# EAGLE board bms14921-v2 (EAGLE 4.13), part 1 of 2
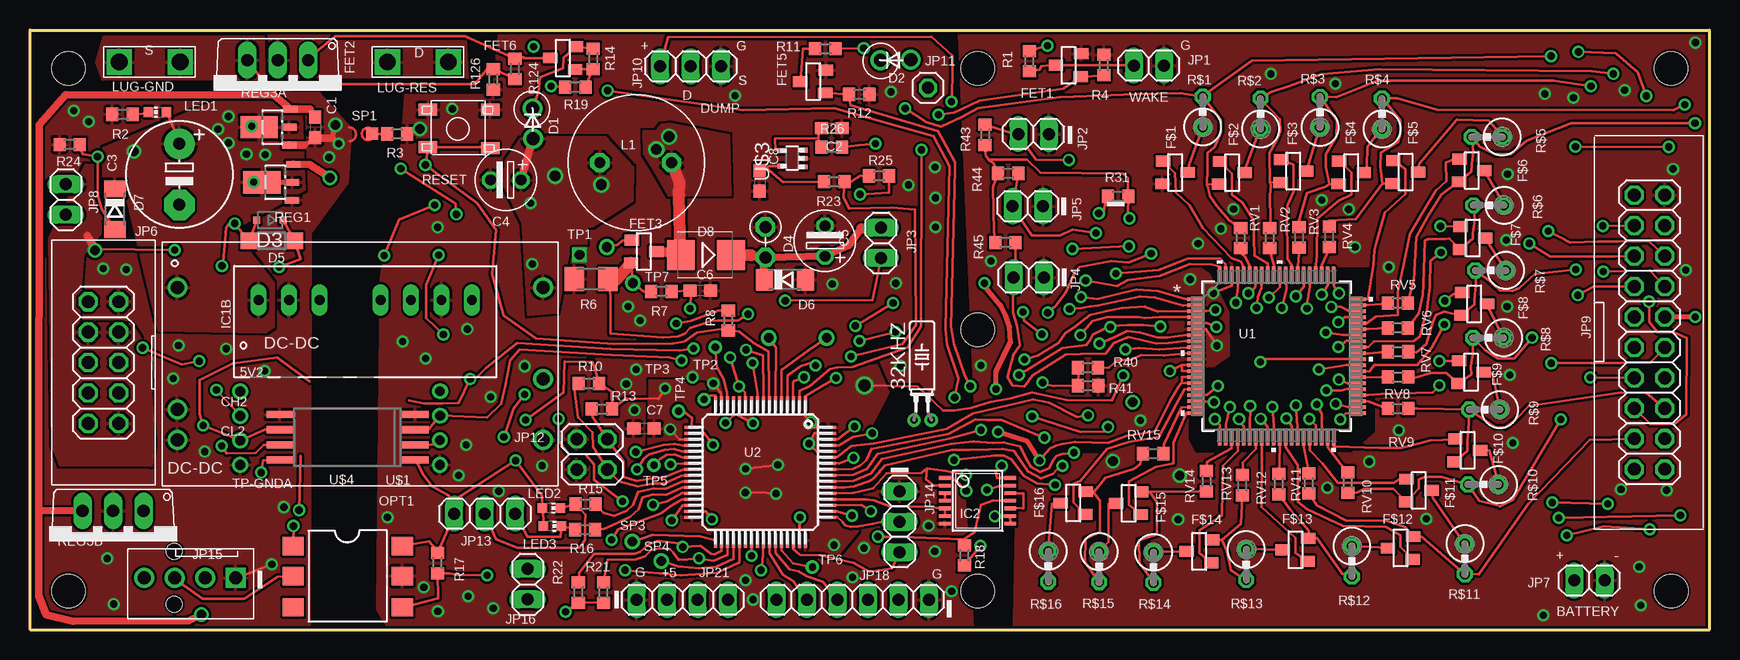
[diagram p2: board, top side]
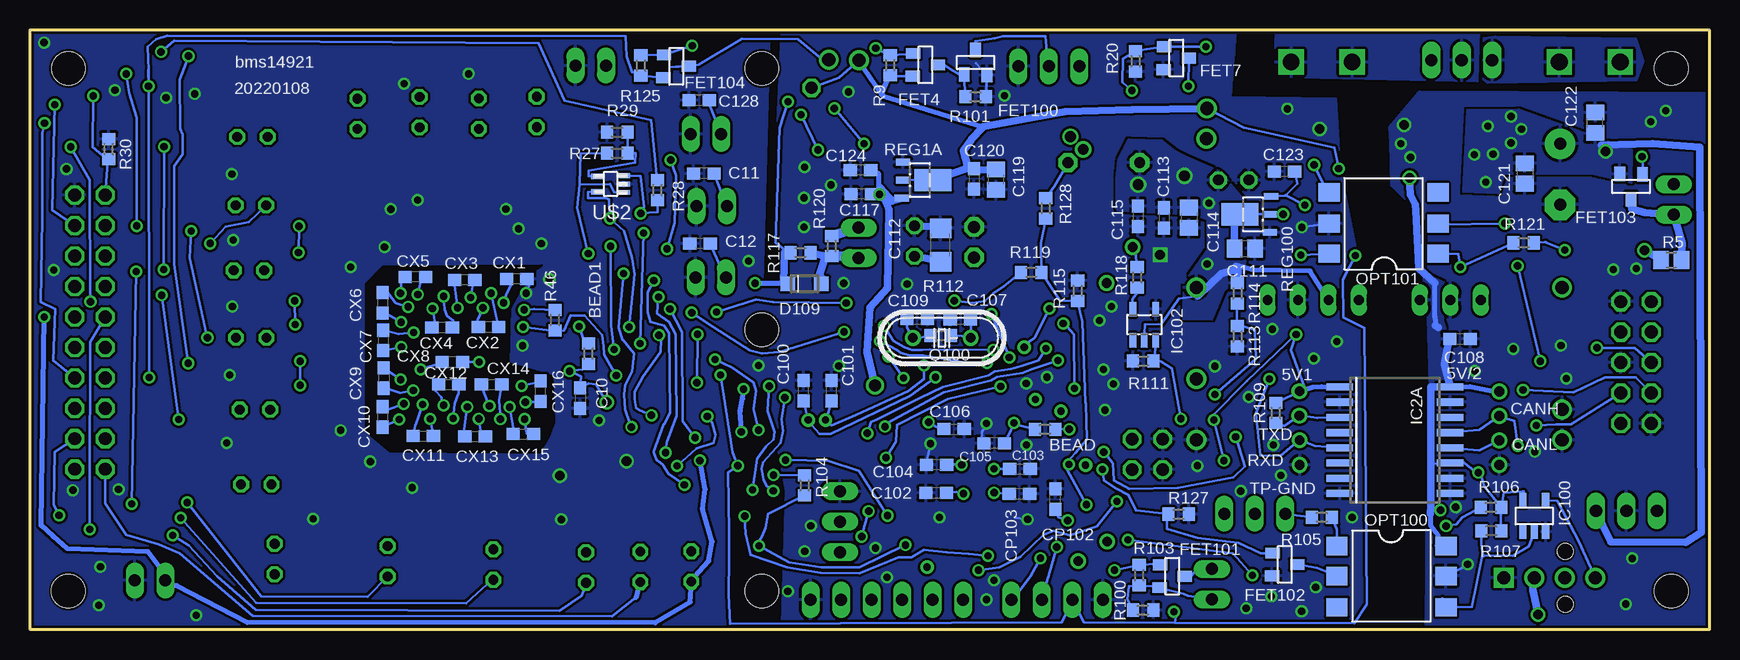
[diagram p3: board, bottom side, seen from below]

Size 140 x 50 mm. Coordinates in mm from the lower left corner, seen from the top.
Outline: 0,0 140,0 140,50 0,50 0,0
Copper layers (1*16): Top 0.035mm / dielectric 1.5mm / Bottom 0.035mm
Design rules "default": minimum track width 8mil, minimum drill 0.6mm, track to track 8mil, track to pad 8mil, pad to pad 8mil, via to via 8mil, smd to smd 0mil, copper to edge 8mil, drill to drill 8mil, minimum pad ring 10mil, minimum via ring 8mil, stop-mask expansion 4mil, vias tented up to drill 0mil, thermal gap 10mil
Holes 2.8 mm at 136.79,46.8 3.2,46.8 3.2,3.21 136.8,3.21 79,46.8 79,3.2 79,25

## Footprints (pad centres in the part's own frame; a part is rotated, then mirrored left to right if it is on the bottom)
SOLPAD028 = drill 0.8 pad 1.1 round: MP 0,0
32KHZ = drill 0.6 round: 1 -0.67,-3.1; 2 0.77,-3.1
R0603 = smd 1 x 1.1: 1 -0.85,0; 2 0.85,0
C0603 = smd 1.1 x 1: 1 -0.85,0; 2 0.85,0
E5-8,5 = drill 1.016 pad 2.54 round: + -2.54,0 | drill 1.016 pad 2.54 octagon: - 2.54,0
ES-2,5L = drill 0.889 pad 1.27 octagon: 1 0,0; 2 2.54,0
C0805 = smd 1.3 x 1.5: 1 -0.85,0; 2 0.85,0
C1206 = smd 1.6 x 1.8: 1 -1.4,0; 2 1.4,0
DO41-10_VERT = drill 1.1 round: A 2.58,0.05; C 0.07,0
SOD323-R = smd 0.6 x 0.6: A 1.1,0; C -1.1,0
ZENER-VERT = drill 1 pad 1.6 octagon: 1 0,0; 2 2.54,0
SOD123 = smd 1.4 x 1.4: A 1.9,0; C -1.9,0
SOD80C = smd 1.4 x 1.8: A 1.7,0; C -1.7,0
SMB_1 = smd 2.3 x 2.5: A 1.9,0; C -2.3,0
SOD123W = smd 1.2 x 1.2: A 1.4,0; C -1.4,0
SOT-23 = smd 0.9 x 1.2: 1 -1,-1.006; 2 0.9,-1.056; 3 -0.05,1.056
TO220V = drill 1.016 long: 1 -2.54,-2.54; 2 0,-2.54; 3 2.54,-2.54
DCDC7PINB = drill 0.813 long: 1 -7.62,2.51; 2 -5.08,2.51; 3 -2.54,2.51; 5 2.54,2.51; 6 5.08,2.51; 7 7.62,2.51; 8 10.16,2.51
TSSOP14 = smd 0.305 x 0.991: 1 -1.905,-2.718; 2 -1.27,-2.718; 3 -0.635,-2.718; 4 0,-2.718; 5 0.635,-2.718; 6 1.27,-2.718; 7 1.905,-2.718; 8 1.905,2.718; 9 1.27,2.718; 10 0.635,2.718; 11 0,2.718; 12 -0.635,2.718; 13 -1.27,2.718; 14 -1.905,2.718
SO-16DW = smd 0.6 x 2.2: 1 -4.445,-4.6; 2 -3.175,-4.6; 3 -1.905,-4.6; 4 -0.635,-4.6; 5 0.635,-4.6; 6 1.905,-4.6; 7 3.175,-4.6; 8 4.445,-4.6; 9 4.445,4.6; 10 3.175,4.6; 11 1.905,4.6; 12 0.635,4.6; 13 -0.635,4.6; 14 -1.905,4.6; 15 -3.175,4.6; 16 -4.445,4.6
SOT-23' = smd 0.6 x 1.2: 1 -0.95,-1.306; 2 0,-1.306; 3 0.95,-1.306; 4 0.95,1.306; 5 -0.95,1.306
SOT23-5 = smd 0.55 x 1.2: 1 -0.95,-1.3; 2 0,-1.3; 3 0.95,-1.3; 4 0.95,1.3; 5 -0.95,1.3
1X02 = drill 1 long: 1 -1.27,0; 2 1.27,0
2X05_KEYED = drill 1.067 octagon: 1 -5.08,-1.27; 2 -5.08,1.27; 3 -2.54,-1.27; 4 -2.54,1.27; 5 0,-1.27; 6 0,1.27; 7 2.54,-1.27; 8 2.54,1.27; 9 5.08,-1.27; 10 5.08,1.27
2X10_KEYED = drill 1.067 octagon: 1 -11.46,-1.27; 2 -11.46,1.27; 3 -8.92,-1.27; 4 -8.92,1.27; 5 -6.38,-1.27; 6 -6.38,1.27; 7 -3.84,-1.27; 8 -3.84,1.27; 9 -1.3,-1.27; 10 -1.3,1.27; 11 1.24,-1.27; 12 1.24,1.27; 13 3.78,-1.27; 14 3.78,1.27; 15 6.32,-1.27; 16 6.32,1.27; 17 8.86,-1.27; 18 8.86,1.27; 19 11.4,-1.27; 20 11.4,1.27
1X03 = drill 1 long: 1 -2.54,0; 2 0,0; 3 2.54,0
1X01 = drill 1 octagon: 1 0,0
2X02 = drill 1.016 octagon: 1 -1.27,-1.27; 2 -1.27,1.27; 3 1.27,-1.27; 4 1.27,1.27
1X4-MOLEXKK = drill 1.1 square: 1 3.81,0 | drill 1.1 round: 2 1.27,0; 3 -1.27,0; 4 -3.81,0 | hole 1.3: -1.3,2.2; -1.3,-2.2
1X06 = drill 1 long: 1 -6.35,0; 2 -3.81,0; 3 -1.27,0; 4 1.27,0; 5 3.81,0; 6 6.35,0
1X04 = drill 1 long: 1 -3.81,0; 2 -1.27,0; 3 1.27,0; 4 3.81,0
INDUCTOR6.0 = drill 0.9 pad 1.6 octagon: 1 -3.04,0; 2 2.94,0
CHIP-LED0603 = smd 0.8 x 0.8: A 0,-0.75; C 0,0.75
SPADE_TAB = drill 1.4 square: G1 -2.54,0; G2 2.54,0
SMD-6 = smd 1.52 x 1.78: P$1 -2.5,-4.5; P$2 0,-4.5; P$3 2.6,-4.5; P$4 2.6,4.6; P$5 0,4.6; P$6 -2.5,4.6
HC49/S = drill 0.8 round: 1 -2.413,0; 2 2.413,0
R0805 = smd 1.3 x 1.5: 1 -0.85,0; 2 0.85,0
M1206 = smd 1.6 x 2: 1 -1.4,0; 2 1.4,0
0309V = drill 0.813 octagon: 1 -1.27,0; 2 1.27,0
SOT89 = smd 0.55 x 1.2: 1 -1.5,-1.4; 2 0,-1.4; 3 1.5,-1.5 | smd 1.85 x 3.1: 4 0,1.1
TO220V' = drill 1.016 long: 1 -3.81,-1.27; 2 -1.27,-1.27; 3 1.27,-1.27
E-SWITCH2 = smd 1.55 x 1: 1 -2.7,1.6; 2 2.5,1.5; 3 2.5,-1.6; 4 -2.7,-1.6
SMD03 = smd 1 x 1: 1 0,0
SOLPAD.6MM = drill 0.6 pad 1.1 round: MP 0,0
21-0072F_MXM = smd 1.359 x 0.279: 1 -6.776,4.75; 2 -6.776,4.25; 3 -6.776,3.75; 4 -6.776,3.25; 5 -6.776,2.75; 6 -6.776,2.25; 7 -6.776,1.75; 8 -6.776,1.25; 9 -6.776,0.75; 10 -6.776,0.25; 11 -6.776,-0.25; 12 -6.776,-0.75; 13 -6.776,-1.25; 14 -6.776,-1.75; 15 -6.776,-2.25; 16 -6.776,-2.75; 17 -6.776,-3.25; 18 -6.776,-3.75; 19 -6.776,-4.25; 20 -6.776,-4.75; 41 6.776,-4.75; 42 6.776,-4.25; 43 6.776,-3.75; 44 6.776,-3.25; 45 6.776,-2.75; 46 6.776,-2.25; 47 6.776,-1.75; 48 6.776,-1.25; 49 6.776,-0.75; 50 6.776,-0.25; 51 6.776,0.25; 52 6.776,0.75; 53 6.776,1.25; 54 6.776,1.75; 55 6.776,2.25; 56 6.776,2.75; 57 6.776,3.25; 58 6.776,3.75; 59 6.776,4.25; 60 6.776,4.75 | smd 0.279 x 1.359: 21 -4.75,-6.776; 22 -4.25,-6.776; 23 -3.75,-6.776; 24 -3.25,-6.776; 25 -2.75,-6.776; 26 -2.25,-6.776; 27 -1.75,-6.776; 28 -1.25,-6.776; 29 -0.75,-6.776; 30 -0.25,-6.776; 31 0.25,-6.776; 32 0.75,-6.776; 33 1.25,-6.776; 34 1.75,-6.776; 35 2.25,-6.776; 36 2.75,-6.776; 37 3.25,-6.776; 38 3.75,-6.776; 39 4.25,-6.776; 40 4.75,-6.776; 61 4.75,6.776; 62 4.25,6.776; 63 3.75,6.776; 64 3.25,6.776; 65 2.75,6.776; 66 2.25,6.776; 67 1.75,6.776; 68 1.25,6.776; 69 0.75,6.776; 70 0.25,6.776; 71 -0.25,6.776; 72 -0.75,6.776; 73 -1.25,6.776; 74 -1.75,6.776; 75 -2.25,6.776; 76 -2.75,6.776; 77 -3.25,6.776; 78 -3.75,6.776; 79 -4.25,6.776; 80 -4.75,6.776
TQFP64 = smd 1.2 x 0.26: 1 -5.7,3.75; 2 -5.7,3.25; 3 -5.7,2.75; 4 -5.7,2.25; 5 -5.7,1.75; 6 -5.7,1.25; 7 -5.7,0.75; 8 -5.7,0.25; 9 -5.7,-0.25; 10 -5.7,-0.75; 11 -5.7,-1.25; 12 -5.7,-1.75; 13 -5.7,-2.25; 14 -5.7,-2.75; 15 -5.7,-3.25; 16 -5.7,-3.75; 33 5.7,-3.75; 34 5.7,-3.25; 35 5.7,-2.75; 36 5.7,-2.25; 37 5.7,-1.75; 38 5.7,-1.25; 39 5.7,-0.75; 40 5.7,-0.25; 41 5.7,0.25; 42 5.7,0.75; 43 5.7,1.25; 44 5.7,1.75; 45 5.7,2.25; 46 5.7,2.75; 47 5.7,3.25; 48 5.7,3.75 | smd 0.26 x 1.2: 17 -3.75,-5.7; 18 -3.25,-5.7; 19 -2.75,-5.7; 20 -2.25,-5.7; 21 -1.75,-5.7; 22 -1.25,-5.7; 23 -0.75,-5.7; 24 -0.25,-5.7; 25 0.25,-5.7; 26 0.75,-5.7; 27 1.25,-5.7; 28 1.75,-5.7; 29 2.25,-5.7; 30 2.75,-5.7; 31 3.25,-5.7; 32 3.75,-5.7; 49 3.75,5.7; 50 3.25,5.7; 51 2.75,5.7; 52 2.25,5.7; 53 1.75,5.7; 54 1.25,5.7; 55 0.75,5.7; 56 0.25,5.7; 57 -0.25,5.7; 58 -0.75,5.7; 59 -1.25,5.7; 60 -1.75,5.7; 61 -2.25,5.7; 62 -2.75,5.7; 63 -3.25,5.7; 64 -3.75,5.7
SOIC-8 = smd 0.6 x 2.2: 1 -1.905,-5.6; 2 -0.635,-5.6; 3 0.635,-5.6; 4 1.905,-5.6; 5 1.905,5.7; 6 0.635,5.7; 7 -0.635,5.7; 8 -1.905,5.7
SC-70-5 = smd 0.4 x 0.95: 1 -0.705,-1.126; 2 -0.005,-1.126; 3 0.695,-1.126 | smd 0.45 x 0.95: 4 0.645,1.136; 5 -0.655,1.136
SOT-323-5 = smd 0.4 x 0.6: 1 -0.7,-0.95; 2 0,-0.95; 3 0.7,-0.95; 4 0.65,0.95; 5 -0.65,0.95
PYJ6-OD = drill 1.1 round: P$1 -7.62,12.7; P$2 -7.62,2.54; P$3 -7.62,0; P$4 22.86,0; P$5 22.86,5.08; P$6 22.86,12.7

## Placement (x,y rotation side)
5V1  SOLDPAD028  [SOLPAD028]  34.18,19.87 0 top
5V2  SOLDPAD028  [SOLPAD028]  17.52,19.85 0 top
32KHZ  X100  [32KHZ]  74.36,20.57 0 top
BEAD  1  [R0603]  55.39,16.7 180 bottom
BEAD1  1  [R0603]  93.44,23.01 90 bottom
C1  1u  [C0603]  23.79,41.88 270 top
C2  1u  [C0603]  66.84,41.81 0 top
C3  0.1u  [E5-8,5]  12.45,37.97 270 top
C4  10@25V  [ES-2,5L]  40.94,37.49 180 top
C5  1u@100v  [ES-2,5L]  66.27,31.13 90 top
C6  0.1u  [C0603]  55.87,28.28 0 top
C7  100n  [C0603]  51.18,16.76 180 top
C8  1u  [C0603]  60.82,37.42 270 top
C10  1u  [C0603]  94.14,19.29 270 bottom
C11  1u  [C0603]  83.84,38.04 180 bottom
C12  1u  [C0603]  84.15,32.2 180 bottom
C100  10p  [C0603]  75.51,19.91 90 bottom
C101  10p  [C0603]  73.17,19.91 90 bottom
C102  100n  [C0603]  64.46,11.38 180 bottom
C103  100n  [C0603]  57.48,13.38 0 bottom
C104  1u  [C0603]  64.43,13.73 180 bottom
C105  100n  [C0603]  59.63,15.54 180 bottom
C106  100n  [C0603]  62.97,16.71 0 bottom
C107  15p  [C0603]  62.45,25.86 180 bottom
C108  4.7u  [C0603]  20.8,24.25 0 bottom
C109  15p  [C0603]  66.05,25.89 0 bottom
C111  [C0805]  38.73,31.76 0 bottom
C112  1u@100v  [C1206]  64.09,32.06 90 bottom
C113  10n  [C0603]  45.48,34.32 270 bottom
C114  4.7u  [C0805]  43.4,34.34 270 bottom
C115  0.1u  [C0603]  47.65,34.46 270 bottom
C117  100n  [C0603]  70.71,36.31 180 bottom
C119  [C0805]  59.5,37.52 270 bottom
C120  100n  [C0603]  61.31,37.59 270 bottom
C121  4.7u  [C0805]  15.4,38.04 270 bottom
C122  4.7u  [C0805]  9.54,42.26 90 bottom
C123  4.7u  [C0603]  35.43,38.2 180 bottom
C124  4.7u  [C0603]  70.77,38.33 180 bottom
C128  1u  [C0603]  84.22,44.14 180 bottom
CANH  SOLDPAD028  [SOLPAD028]  17.52,17.81 0 top
CANL  SOLDPAD028  [SOLPAD028]  17.52,15.77 0 top
CP102  4.7u  [C0603]  54.54,10.88 90 bottom
CP103  4.7u  [C0603]  57.52,11.33 0 bottom
CX1  1u  [C0603]  99.43,29.24 180 bottom
CX2  1u  [C0603]  101.78,25.22 180 bottom
CX3  1u  [C0603]  103.76,29.16 180 bottom
CX4  1u  [C0603]  105.65,25.18 180 bottom
CX5  1u  [C0603]  107.87,29.4 180 bottom
CX6  1u  [C0603]  110.61,27.25 270 bottom
CX7  1u  [C0603]  110.57,24.11 270 bottom
CX8  1u  [C0603]  104.79,22.3 180 bottom
CX9  1u  [C0603]  110.51,20.97 270 bottom
CX10  1u  [C0603]  110.6,17.73 270 bottom
CX11  1u  [C0603]  107.22,16.14 0 bottom
CX12  1u  [C0603]  105.1,20.43 0 bottom
CX13  1u  [C0603]  102.9,16.1 0 bottom
CX14  1u  [C0603]  101.52,20.43 0 bottom
CX15  1u  [C0603]  98.87,16.31 0 bottom
CX16  1u  [C0603]  97.42,19.88 90 bottom
D1  1N4148  [DO41-10_VERT]  41.89,43.52 270 top
D2  1N4148  [DO41-10_VERT]  70.83,47.48 0 top
D3  [SOD323-R]  20,34.15 180 top
D4  1N5357  [ZENER-VERT]  61.3,33.58 270 top
D5  1N4148  [SOD123]  20.15,32.41 180 top
D6  MMSZ52  [SOD80C]  62.94,29.18 0 top
D7  MMSZ52  [SOD80C]  7.08,35.05 270 top
D8  B100LB  [SMB_1]  56.14,31.23 180 top
D109  PMEG10020  [SOD123W]  75.43,28.83 180 bottom
F$1  [SOT-23]  95.45,38.07 270 top
F$2  [SOT-23]  100.19,38.05 270 top
F$3  [SOT-23]  105.31,38.18 270 top
F$4  [SOT-23]  110.13,38.06 270 top
F$5  [SOT-23]  114.65,38.1 270 top
F$6  [SOT-23]  120.17,38.23 270 top
F$7  [SOT-23]  120.26,32.6 270 top
F$8  [SOT-23]  120.39,27.11 270 top
F$9  [SOT-23]  120.12,21.41 270 top
F$10  [SOT-23]  119.82,14.89 270 top
F$11  [SOT-23]  115.77,11.55 270 top
F$12  [SOT-23]  114.24,6.85 90 top
F$13  [SOT-23]  105.48,6.7 90 top
F$14  [SOT-23]  97.47,6.57 90 top
F$15  [SOT-23]  91.59,10.58 90 top
F$16  [SOT-23]  86.96,10.6 90 top
FET1  NFET  [SOT-23]  86.58,47.11 90 top
FET2  100v NFET  [TO220V]  20.66,44.95 180 top
FET3  PMV280ENEA  [SOT-23]  51.16,31.48 270 top
FET4  PFET  [SOT-23]  65.37,47.04 270 bottom
FET5  NFET  [SOT-23]  65.28,45.75 90 top
FET6  PFET  [SOT-23]  44.43,47.71 90 top
FET7  NFET  [SOT-23]  44.45,47.6 270 bottom
FET100  si2324A  [SOT-23]  61.13,47.29 0 bottom
FET101  NFET  [SOT-23]  44.79,4.4 270 bottom
FET102  NFET  [SOT-23]  35.41,5.37 270 bottom
FET103  PMV35EPE  [SOT-23]  6.59,36.94 180 bottom
FET104  PFET  [SOT-23]  86.14,46.92 270 bottom
IC1B  AM6G1215SNZ  [DCDC7PINB]  26.68,24.97 0 top
IC2  7402  [TSSOP14]  78.99,10.74 270 top
IC2A  ISO1042-16PIN  [SO-16DW]  26.22,15.79 270 bottom
IC100  74LVC1G14  [SOT-23']  14.61,9.47 0 bottom
IC102  MCP1401|1416  [SOT23-5]  47.11,25.42 0 bottom
JP1  PB  [1X02]  93.27,47.03 180 top
JP2  THERM1  [1X02]  83.65,41.32 180 top
JP3  [1X02]  70.93,32.25 90 top
JP4  THERM2  [1X02]  83.25,29.37 180 top
JP5  THERM3  [1X02]  83.17,35.31 180 top
JP6  PINHD-2X5_KEYED  [2X05_KEYED]  6.13,22.26 90 top
JP7  [1X02]  129.99,4.09 180 top
JP8  Dump2  [1X02]  2.98,35.86 90 top
JP9  PINHD-2X10_KEYED  [2X10_KEYED]  134.99,24.77 270 top
JP10  DUMP  [1X03]  55.07,46.97 0 top
JP11  [1X01]  74.85,45.17 0 top
JP12  [2X02]  46.85,14.61 270 top
JP13  [1X03]  37.91,9.65 0 top
JP14  SWD  [1X03]  72.48,8.99 270 top
JP15  PINHD-1X4-MOLEXKK  [1X4-MOLEXKK]  13.33,4.31 0 top
JP16  Dump2  [1X02]  41.48,3.78 90 top
JP18  FTDI  [1X06]  68.57,2.48 180 top
JP21  [1X04]  54.38,2.48 0 top
L1  RFB1010  [INDUCTOR6.0]  50.54,38.93 0 top
LED1  [CHIP-LED0603]  10.64,43.15 90 top
LED2  [CHIP-LED0603]  43.47,10.13 270 top
LED3  [CHIP-LED0603]  43.55,8.61 270 top
LUG-GND  MINUS  [SPADE_TAB]  9.97,47.33 0 top
LUG-RES  RESIS  [SPADE_TAB]  32.33,47.33 0 top
OPT1  H11L1S  [SMD-6]  26.44,4.46 270 top
OPT100  H11L1S  [SMD-6]  26.56,4.46 270 bottom
OPT101  H11L1S  [SMD-6]  27.12,33.85 90 bottom
Q100  [HC49/S]  63.99,24.32 180 bottom
R1  100K  [R0603]  83.31,47.4 270 top
R2  6.8K  [R0603]  7.72,42.96 0 top
R3  10M  [R0603]  30.6,41.33 0 top
R4  1M  [R0603]  89.51,47.07 270 top
R5  0.1  [R0805]  3.19,30.82 0 bottom
R6  0.1  [M1206]  46.77,29.21 0 top
R7  1.8K  [R0603]  52.64,28.19 0 top
R8  10K  [R0603]  58.21,25.77 90 top
R9  1M  [R0603]  68.3,47.06 270 bottom
R10  10K  [R0603]  46.59,20.52 0 top
R11  100K  [R0603]  66.3,48.43 180 top
R12  1M  [R0603]  69.14,44.63 0 top
R13  10K  [R0603]  47.67,18.39 0 top
R14  1M  [R0603]  46.94,47.59 90 top
R15  6.8K  [R0603]  46.31,10.46 0 top
R16  3.3K  [R0603]  46.27,8.34 0 top
R17  10K  [R0603]  33.97,5.55 90 top
R18  470K  [R0603]  77.89,6.19 270 top
R19  100K  [R0603]  45.45,45.23 180 top
R20  1M  [R0603]  47.85,47.39 90 bottom
R21  3.3K  [R0603]  47.81,3.1 270 top
R22  3.3K  [R0603]  45.71,3.1 270 top
R23  zero?  [R0603]  67.03,37.35 0 top
R24  1M  [R0603]  3.31,40.45 180 top
R25  zero?  [R0603]  70.77,37.83 0 top
R26  100K  [R0603]  66.83,40.22 0 top
R27  10K  [R0603]  91.05,39.72 0 bottom
R28  1K ?  [R0603]  87.69,36.65 270 bottom
R29  1K  [R0603]  91.05,41.47 0 bottom
R30  ZERO?  [R0603]  133.44,40.06 270 bottom
R31  49K  [R0603]  90.7,36.13 180 top
R40  1K  [R0603]  88.19,21.83 180 top
R41  4.7K  [R0603]  88.2,20.34 180 top
R43  10K  [R0603]  79.61,41.26 90 top
R44  10K  [R0603]  81.54,38.05 0 top
R45  10K  [R0603]  81.31,32.28 0 top
R46  4.7K  [R0603]  96.24,25.8 270 bottom
R100  10K  [R0603]  47.22,1.62 0 bottom
R101  100K  [R0603]  61.18,44.43 180 bottom
R103  2M  [R0603]  47.54,4.53 270 bottom
R104  470K  [R0603]  75.43,12.02 270 bottom
R105  1.8K  [R0603]  32.31,9.36 180 bottom
R106  1.8K  [R0603]  18.22,10.2 180 bottom
R107  10K  [R0603]  18.19,8.24 0 bottom
R109  100K  [R0603]  36.15,18.06 90 bottom
R111  470K  [R0603]  47.21,22.39 0 bottom
R112  1M  [R0603]  64.09,24.51 0 bottom
R113  6.8K  [R0603]  39.35,24.45 270 bottom
R114  33K  [R0603]  39.35,28.03 270 bottom
R115  3.3K  [R0603]  52.67,28.25 270 bottom
R117  zero?  [R0603]  75.77,31.42 0 bottom
R118  6.8  [R0603]  47.71,29.38 270 bottom
R119  omit?  [R0603]  56.54,29.78 180 bottom
R120  1  [R0603]  73.17,31.98 270 bottom
R121  3.3K  [R0603]  15.49,32.25 180 bottom
R124  100K  [R0603]  40.42,46.76 90 top
R125  1M  [R0603]  89.08,47.03 270 bottom
R126  1K  [R0603]  38.62,45.89 270 top
R127  1M  [R0603]  44.25,9.62 0 bottom
R128  68K  [R0603]  55.33,35.12 90 bottom
R$1  27  [0309V]  97.76,43.17 90 top
R$2  27  [0309V]  102.58,43.02 90 top
R$3  27  [0309V]  107.53,43.15 90 top
R$4  27  [0309V]  112.7,43.01 90 top
R$5  27  [0309V]  121.45,41.08 180 top
R$6  27  [0309V]  121.59,35.38 180 top
R$7  27  [0309V]  121.75,29.95 180 top
R$8  27  [0309V]  121.56,24.33 180 top
R$9  27  [0309V]  121.25,18.34 180 top
R$10  27  [0309V]  121.14,12.1 180 top
R$11  27  [0309V]  119.61,5.88 270 top
R$12  27  [0309V]  110.19,5.69 270 top
R$13  27  [0309V]  101.38,5.41 270 top
R$14  27  [0309V]  93.65,5.17 270 top
R$15  27  [0309V]  89.12,5.22 270 top
R$16  27  [0309V]  84.88,5.26 270 top
REG1  AP7380Y  [SOT89]  20.44,37.3 90 top
REG1A  AP7380Y  [SOT89]  65.83,37.48 270 bottom
REG3A  LDK320ADU120R  [SOT89]  20.21,41.9 90 top
REG3B  LM7812T  [TO220V']  5.65,8.62 180 top
REG100  AP7380Y  [SOT89]  38.05,34.62 90 bottom
RESET  RESET  [E-SWITCH2]  35.67,41.74 180 top
RV1  3K  [R0603]  100.92,32.65 270 top
RV2  3K  [R0603]  103.34,32.65 270 top
RV3  3K  [R0603]  105.79,32.7 270 top
RV4  3K  [R0603]  108.31,32.75 270 top
RV5  3K  [R0603]  114.02,27.23 180 top
RV6  3K  [R0603]  114.02,25.15 180 top
RV7  3K  [R0603]  114.03,23.16 180 top
RV8  3K  [R0603]  114.04,21.06 180 top
RV9  3K  [R0603]  114.03,18.43 180 top
RV10  3K  [R0603]  109.85,12.25 90 top
RV11  3K  [R0603]  106.6,12.19 90 top
RV12  3K  [R0603]  104.1,12.14 90 top
RV13  3K  [R0603]  101.05,12.03 90 top
RV14  3K  [R0603]  98.07,12.37 90 top
RV15  3K  [R0603]  93.63,14.67 0 top
RXD  SOLDPAD028  [SOLPAD028]  34.17,15.79 0 top
SP1  SMD03  [SMD03]  28.52,41.34 0 top
SP3  SOLDPAD028  [SOLPAD028]  50.22,7.33 0 top
SP4  SOLDPAD028  [SOLPAD028]  52.62,5.71 0 top
TP1  SOLDPAD028  [SOLPAD028]  48.08,31.9 0 top
TP2  SOLDPAD0.6MM  [SOLPAD.6MM]  57.12,23.54 0 top
TP3  SOLDPAD0.6MM  [SOLPAD.6MM]  56.19,19.19 0 top
TP4  SOLDPAD0.6MM  [SOLPAD.6MM]  54.06,18.21 0 top
TP5  SOLDPAD0.6MM  [SOLPAD.6MM]  52.01,13.7 0 top
TP6  SOLDPAD0.6MM  [SOLPAD.6MM]  65.22,5.2 0 top
TP7  SOLDPAD028  [SOLPAD028]  50.25,28.9 0 top
TP-GND  SOLDPAD028  [SOLPAD028]  34.16,13.73 0 top
TP-GNDA  SOLDPAD028  [SOLPAD028]  17.52,13.73 0 top
TXD  SOLDPAD028  [SOLPAD028]  34.19,17.84 0 top
U1  MAX14921ECS+T  [21-0072F_MXM]  103.92,22.8 0 top
U2  STM32F10XRXT6  [TQFP64]  60.88,13.12 270 top
U$1  ISO1042  [SOIC-8]  26.51,16.04 90 top
U$2  MCP6006  [SC-70-5]  91.6,37.16 90 bottom
U$3  STLQ50  [SOT-323-5]  63.55,39.29 90 top
U$4  PY6J6-OD  [PYJ6-OD]  19.91,15.81 0 top